# Altium schematic sheet Module_RS485.SchDoc
size A4; SheetNumber: 11; SheetTotal: 11
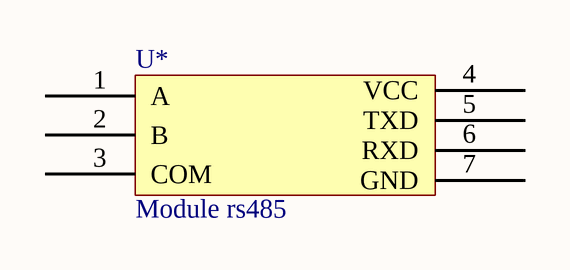
[diagram p0: Module_RS485.SchDoc]

## Parts
U*  Module rs485

## Nets

Not connected (* = marked no-connect by the designer): U* 1(A) 2(B) 3(COM) 4(VCC) 5(TXD) 6(RXD) 7(GND)